# Altium schematic sheet Sheet2.SchDoc
size A3; SheetNumber: 1; SheetTotal: 1
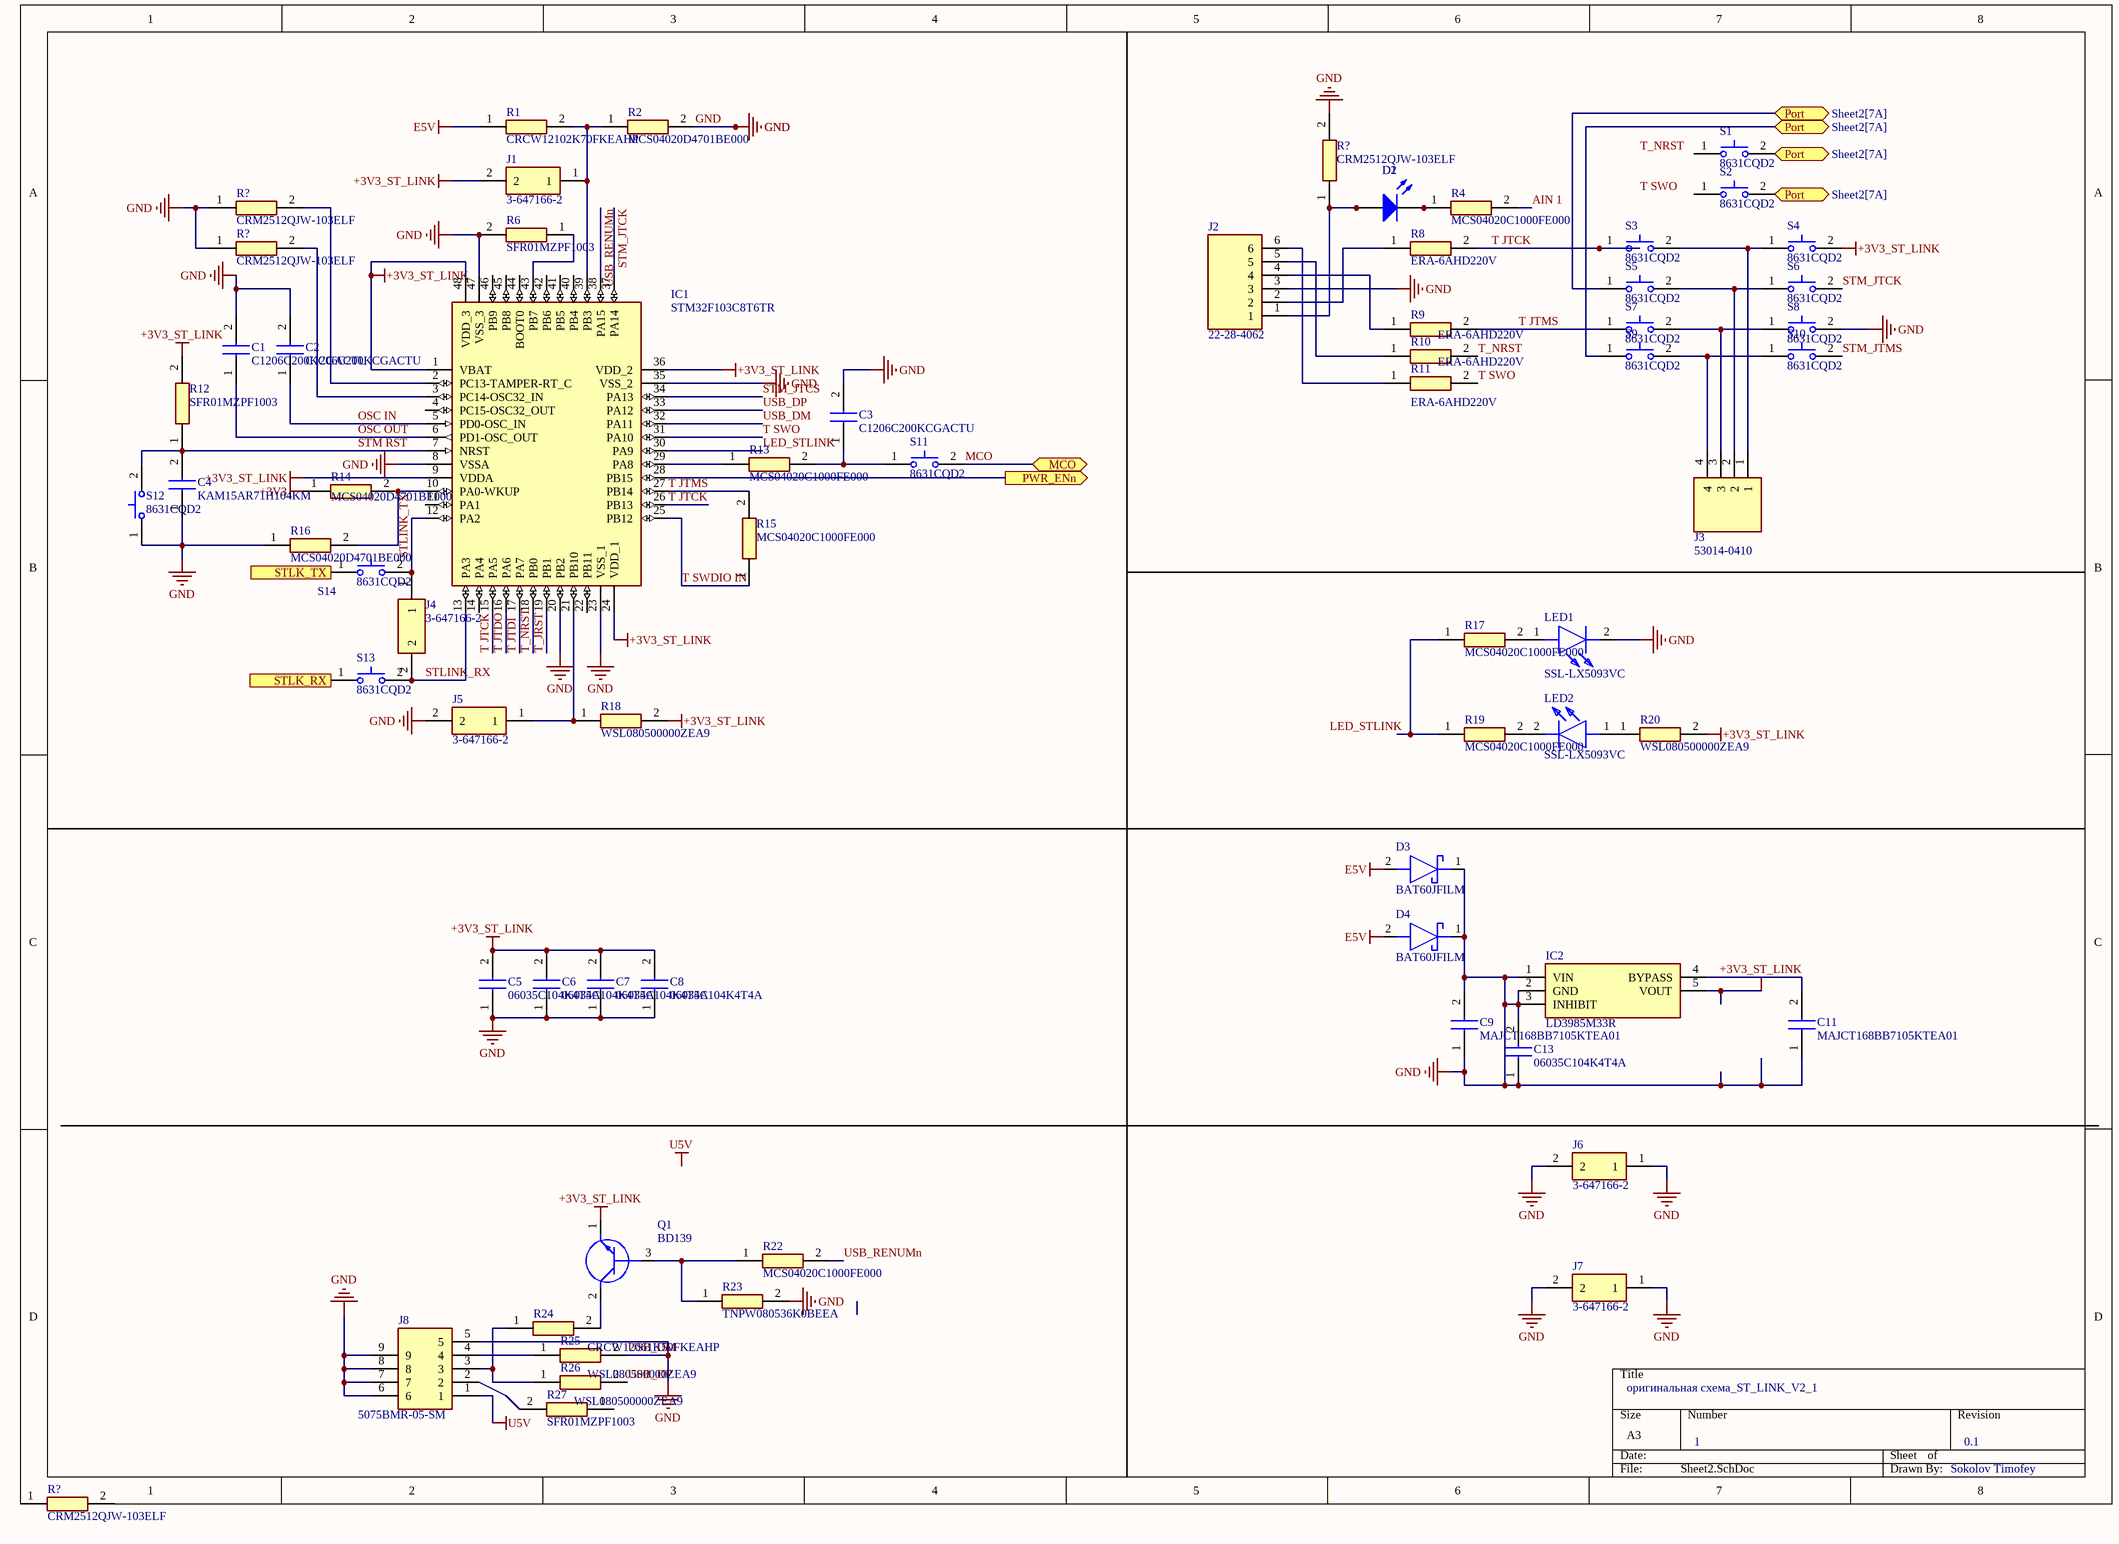
[diagram p0: Sheet2.SchDoc]

## Parts
(Parts that share a designator on the sheet are numbered #1, #2 ... from top to bottom, then left to right.)
C1  C1206C200KCGACTU  [C1206]
C2  C1206C200KCGACTU  [C1206]
C3  C1206C200KCGACTU  [C1206]
C4  KAM15AR71H104KM  [CAPC1608X90N]
C5  06035C104K4T4A  [CAPC1608X90N]
C6  06035C104K4T4A  [CAPC1608X90N]
C7  06035C104K4T4A  [CAPC1608X90N]
C8  06035C104K4T4A  [CAPC1608X90N]
C9  MAJCT168BB7105KTEA01  [MAJx16]
C11  MAJCT168BB7105KTEA01  [MAJx16]
C13  06035C104K4T4A  [CAPC1608X90N]
D1  Light-Emitting Diode  (value not drawn)
D2  Light-Emitting Diode  (value not drawn)
D3  BAT60JFILM  [SOD2513X117N]
D4  BAT60JFILM  [SOD2513X117N]
IC1  STM32F103C8T6TR  [QFP50P900X900X160-48N]
IC2  LD3985M33R  [SOT95P280X145-5N]
J1  3-647166-2  [36471662]
J2  22-28-4062  [HDRV6W66P0X254_1X6_1524X249X838P]
J3  53014-0410  [SHDR4W60P0X200_1X4_1200X435X1000P]
J4  3-647166-2  [36471662]
J5  3-647166-2  [36471662]
J6  3-647166-2  [36471662]
J7  3-647166-2  [36471662]
J8  5075BMR-05-SM  [5075BMR05SM]
LED1  SSL-LX5093VC  [SSLLX5093VC]
LED2  SSL-LX5093VC  [SSLLX5093VC]
Q1  BD139  [TO229P300X760X1364-3P]
R1  CRCW12102K70FKEAHP  [RESC3225X70N]
R2  MCS04020D4701BE000  [RESC1005X37N]
R4  MCS04020C1000FE000  [RESC1005X37N]
R6  SFR01MZPF1003  [RESC1005X40N]
R8  ERA-6AHD220V  [ERA6AEB1020V]
R9  ERA-6AHD220V  [ERA6AEB1020V]
R10  ERA-6AHD220V  [ERA6AEB1020V]
R11  ERA-6AHD220V  [ERA6AEB1020V]
R12  SFR01MZPF1003  [RESC1005X40N]
R13  MCS04020C1000FE000  [RESC1005X37N]
R14  MCS04020D4701BE000  [RESC1005X37N]
R15  MCS04020C1000FE000  [RESC1005X37N]
R16  MCS04020D4701BE000  [RESC1005X37N]
R17  MCS04020C1000FE000  [RESC1005X37N]
R18  WSL080500000ZEA9  [RESC2013X84N]
R19  MCS04020C1000FE000  [RESC1005X37N]
R20  WSL080500000ZEA9  [RESC2013X84N]
R22  MCS04020C1000FE000  [RESC1005X37N]
R23  TNPW080536K0BEEA  [RESC2012X55N]
R24  CRCW12061K50FKEAHP  [RESC3116X65N]
R25  WSL080500000ZEA9  [RESC2013X84N]
R26  WSL080500000ZEA9  [RESC2013X84N]
R27  SFR01MZPF1003  [RESC1005X40N]
R?#1  CRM2512QJW-103ELF  [RESC6331X80N]
R?#2  CRM2512QJW-103ELF  [RESC6331X80N]
R?#3  CRM2512QJW-103ELF  [RESC6331X80N]
R?#4  CRM2512QJW-103ELF  [RESC6331X80N]
S1  8631CQD2  [8631CQD2]
S2  8631CQD2  [8631CQD2]
S3  8631CQD2  [8631CQD2]
S4  8631CQD2  [8631CQD2]
S5  8631CQD2  [8631CQD2]
S6  8631CQD2  [8631CQD2]
S7  8631CQD2  [8631CQD2]
S8  8631CQD2  [8631CQD2]
S9  8631CQD2  [8631CQD2]
S10  8631CQD2  [8631CQD2]
S11  8631CQD2  [8631CQD2]
S12  8631CQD2  [8631CQD2]
S13  8631CQD2  [8631CQD2]
S14  8631CQD2  [8631CQD2]

## Ports
MCO (bidir), Port (bidir, see Sheet2[7A]), PWR_ENn (out), STLK_RX (in), STLK_TX (out)

## Nets
+3V3: R14.1
+3V3_ST_LINK: C5.2 C6.2 C7.2 C8.2 IC1.1(VBAT) IC1.9(VDDA) IC1.24(VDD_1) IC1.36(VDD_2) IC1.48(VDD_3) IC2.5(VOUT) J1.2 Q1.1(E) R12.2 R18.2 R20.2 S4.2(N.O._2)
E5V: D3.2(A) D4.2(A) R1.1
GND: C1.2 C2.2 C3.2 C4.1 C5.1 C6.1 C7.1 C8.1 C9.1 C9.2 C11.1 C13.1 C13.2 D3.1(K) D4.1(K) IC1.8(VSSA) IC1.20(PB2) IC1.23(VSS_1) IC1.32(PA11) IC1.35(VSS_2) IC1.47(VSS_3) IC2.1(VIN) IC2.2(GND) IC2.3(INHIBIT) J2.3 J5.2 J6.1 J6.2 J7.1 J7.2 J8.5 J8.6 J8.7 J8.8 J8.9 LED1.2(K) R2.2 R6.2 R16.1 R23.2 R25.2 R?#1.1 R?#2.2 R?#3.1 S8.2(N.O._2) S12.1(N.O._1)  [also labelled USB_DM]
U5V: J8.1
AIN 1: R4.2
LED_STLINK: IC1.30(PA9)
MCO: S11.2(N.O._2) ; port MCO
OSC IN: C2.1 IC1.5(PD0-OSC_IN)
OSC OUT: C1.1 IC1.6(PD1-OSC_OUT)
Port: S1.2(N.O._2) S2.2(N.O._2) S5.1(N.O._1) S9.1(N.O._1) ; port Port
PWR_ENn: IC1.28(PB15) ; port PWR_ENn
STLINK_RX: IC1.13(PA3) J4.2 S13.2(N.O._2)
STLINK_TX: IC1.12(PA2) J4.1 S14.2(N.O._2)
STLK_RX: S13.1(N.O._1) ; port STLK_RX
STLK_TX: S14.1(N.O._1) ; port STLK_TX
STM RST: C4.2 IC1.7(NRST) R12.1 S12.2(N.O._2)
STM_JTCK: IC1.37(PA14) S6.2(N.O._2)
STM_JTCS: IC1.34(PA13)
STM_JTMS: S10.2(N.O._2)
T JTCK: IC1.15(PA5) IC1.26(PB13) R8.2 S3.1(N.O._1)
T JTDI: IC1.17(PA7)
T JTDO: IC1.16(PA6)
T JTMS: IC1.27(PB14) R9.2 R15.2 S7.1(N.O._1)
T SWDIO IN: IC1.25(PB12) R15.1
T SWO: IC1.31(PA10) R11.2
T_JRST: IC1.19(PB1)
T_NRST: IC1.18(PB0) R10.2
USB_DP: IC1.33(PA12) R26.2
USB_RENUMn: IC1.38(PA15) R22.2
NetC3_1: C3.1 R13.2 S11.1(N.O._1)
NetC11_2: C11.2 IC2.4(BYPASS)
NetD1_1: D1.1(A) D2.1(A) J2.1 R?#2.1
NetD1_2: D1.2(K) D2.2(K) R4.1
NetIC1_2: IC1.2(PC13-TAMPER-RT_C) R?#1.2
NetIC1_3: IC1.3(PC14-OSC32_IN) R?#3.2
NetIC1_10: IC1.10(PA0-WKUP) R14.2 R16.2
NetIC1_21: IC1.21(PB10) J5.1 R18.1
NetIC1_29: IC1.29(PA8) R13.1
NetIC1_39: IC1.39(PB3) J1.1 R1.2 R2.1
NetIC1_43: IC1.43(PB7) R6.1
NetJ2_2: J2.2 R8.1
NetJ2_4: J2.4 R9.1
NetJ2_5: J2.5 R10.1
NetJ2_6: J2.6 R11.1
NetJ3_1: J3.1 S3.2(N.O._2) S4.1(N.O._1)
NetJ3_2: J3.2 S5.2(N.O._2) S6.1(N.O._1)
NetJ3_3: J3.3 S7.2(N.O._2) S8.1(N.O._1)
NetJ3_4: J3.4 S9.2(N.O._2) S10.1(N.O._1)
NetJ8_2: J8.2 R27.2
NetJ8_3: J8.3 R24.1 R26.1
NetJ8_4: J8.4 R25.1
NetLED1_1: LED1.1(A) R17.2
NetLED2_1: LED2.1(A) R20.1
NetLED2_2: LED2.2(K) R19.2
NetQ1_2: Q1.2(C) R24.2
NetQ1_3: Q1.3(B) R22.1 R23.1
NetR17_1: R17.1 R19.1

Not connected (* = marked no-connect by the designer): IC1 4(PC15-OSC32_OUT) 11(PA1) 14(PA4) 22(PB11) 40(PB4) 41(PB5) 42(PB6) 44(BOOT0) 45(PB8) 46(PB9); R27 1; R?#4 1 2; S1 1(N.O._1); S2 1(N.O._1)

## Notes on the sheet
- оригинальная схема_ST_LINK_V2_1
- 1
- 0.1
- Sokolov Timofey
- Labels drawn without touching a wire or pin: LED_STLINK, T SWO, T_NRST, U5V

## Library data of the parts
C1-C3 = C1206C200KCGACTU: Capacitor; Manufacturer_Name: KEMET; Datasheet Link: https://content.kemet.com/datasheets/KEM_C1009_C0G_HV_SMD.pdf; Manufacturer_Part_Number: C1206C200KCGACTU
C4 = KAM15AR71H104KM: Capacitor; Manufacturer_Name: Kyocera AVX; Datasheet Link: https://datasheets.kyocera-avx.com/AutoMLCCKAM.pdf; Height: 0.9mm; Manufacturer_Part_Number: KAM15AR71H104KM; Mouser Part Number: 581-KAM15AR71H104KM; Mouser Price/Stock: https://www.mouser.co.uk/ProductDetail/KYOCERA-AVX/KAM15AR71H104KM?qs=Jm2GQyTW%2FbgzS5FHJWrFzQ%3D%3D; Arrow Part Number: KAM15AR71H104KM; Arrow Price/Stock: https://www.arrow.com/en/products/kam15ar71h104km/avx?region=nac
C5-C8 C13 = 06035C104K4T4A: Capacitor; Manufacturer_Name: Kyocera AVX; Datasheet Link: https://componentsearchengine.com/Datasheets/1/06031A100FAT2A.pdf; Height: 0.9mm; Manufacturer_Part_Number: 06035C104K4T4A; Mouser Part Number: 581-06035C104K4T4A; Mouser Price/Stock: https://www.mouser.co.uk/ProductDetail/KYOCERA-AVX/06035C104K4T4A?qs=NBj5Hwer2CEXBYKT%252BbuSBA%3D%3D; Arrow Part Number: 06035C104K4T4A; Arrow Price/Stock: https://www.arrow.com/en/products/06035c104k4t4a/avx
C9 C11 = MAJCT168BB7105KTEA01: Capacitor; Manufacturer_Name: TAIYO YUDEN; Datasheet Link: https://ds.yuden.co.jp/TYCOMPAS/or/detail?pn=MAJCT168BB7105KTEA01; Height: 0.8mm; Manufacturer_Part_Number: MAJCT168BB7105KTEA01
D1 D2 = LED: AF: 1; BV: 0; BV_MAX: 1e99; EG: 1.11; FC: 0.5; IBV: 0.001; IS: 1e-14; MJSW: 0.33; NTUN: 30; TNOM: 27; XTI: 3; SimulationGenericComponent: True; CJO: 0; CJP: 0; CTA: 0; CTP: 0; FCS: 0.5; FV_MAX: 1e99; IKF: 0; IKR: 0; ISR: 1e-14; JSW: 0; JTUN: 0; JTUNSW: 0; KEG: 1; KF: 0; LEVEL: 1; N: 1; NBV: 1; NR: 1; NS: 1; PHP: 1; RS: 0; TCV: 0; TLEV: 0; TLEVC: 0; TM1: 0; TM2: 0; TPB: 0; TPHP: 0; TRS: 0; TRS2: 0; TT: 0; TTT1: 0; TTT2: 0; VJ: 1; XTITUN: 3
D3 D4 = BAT60JFILM: Schottky Diode; Manufacturer_Name: STMicroelectronics; Datasheet Link: https://www.mouser.jp/datasheet/2/389/cd00001944-1795661.pdf; Height: 1.17mm; Manufacturer_Part_Number: BAT60JFILM; Mouser Part Number: 511-BAT60JFILM; Mouser Price/Stock: https://www.mouser.co.uk/ProductDetail/STMicroelectronics/BAT60JFILM?qs=GnFZssByvVVVnMaukcyLZg%3D%3D; Arrow Part Number: BAT60JFILM; Arrow Price/Stock: https://www.arrow.com/en/products/bat60jfilm/stmicroelectronics?region=nac
IC1 = STM32F103C8T6TR: Integrated Circuit; Manufacturer_Name: STMicroelectronics; Datasheet Link: http://media.digikey.com/pdf/Data%20Sheets/ST%20Microelectronics%20PDFS/STM32F103x8,B.pdf; Height: 1.6mm; Manufacturer_Part_Number: STM32F103C8T6TR; Mouser Part Number: 511-STM32F103C8T6TR; Mouser Price/Stock: https://www.mouser.co.uk/ProductDetail/STMicroelectronics/STM32F103C8T6TR?qs=5HwTSiuA5HDxFj62n06yag%3D%3D; Arrow Part Number: STM32F103C8T6TR; Arrow Price/Stock: https://www.arrow.com/en/products/stm32f103c8t6tr/stmicroelectronics?region=nac
IC2 = LD3985M33R: Integrated Circuit; Manufacturer_Name: STMicroelectronics; Datasheet Link: http://www.st.com/st-web-ui/static/active/en/resource/technical/document/datasheet/CD00003395.pdf; Height: 1.45mm; Manufacturer_Part_Number: LD3985M33R; Mouser Part Number: 511-LD3985M33R; Mouser Price/Stock: https://www.mouser.co.uk/ProductDetail/STMicroelectronics/LD3985M33R?qs=22WmWNTp1rrPOccVv4HZ7A%3D%3D; Arrow Part Number: LD3985M33R; Arrow Price/Stock: https://www.arrow.com/en/products/ld3985m33r/stmicroelectronics?region=europe
J1 J4-J7 = 3-647166-2: Connector; Manufacturer_Name: TE Connectivity; Datasheet Link: https://www.te.com/commerce/DocumentDelivery/DDEController?Action=showdoc&DocId=Customer+Drawing%7F647166%7FR1%7Fpdf%7FEnglish%7FENG_CD_647166_R1.pdf%7F3-647166-2; Height: 10.66mm; Manufacturer_Part_Number: 3-647166-2; Mouser Part Number: 571-3-647166-2; Mouser Price/Stock: https://www.mouser.co.uk/ProductDetail/TE-Connectivity/3-647166-2?qs=xsTFCgGnzbJU1qz6Np9kzA%3D%3D; Arrow Part Number: 3-647166-2; Arrow Price/Stock: https://www.arrow.com/en/products/3-647166-2/te-connectivity?region=nac
J2 = 22-28-4062: Connector; Manufacturer_Name: Molex; Datasheet Link: https://datasheet.datasheetarchive.com/originals/distributors/SFDatasheet-1/sf-00031037.pdf; Height: 8.38mm; Manufacturer_Part_Number: 22-28-4062; Mouser Part Number: 538-22-28-4062; Mouser Price/Stock: https://www.mouser.com/Search/Refine.aspx?Keyword=538-22-28-4062
J3 = 53014-0410: Connector; Manufacturer_Name: Molex; Datasheet Link: https://www.molex.com/pdm_docs/sd/530140410_sd.pdf; Height: 10mm; Manufacturer_Part_Number: 53014-0410; Mouser Part Number: 538-53014-0410; Mouser Price/Stock: https://www.mouser.co.uk/ProductDetail/Molex/53014-0410?qs=TLs3Kb%252BkMqKk8s1WRHwRGw%3D%3D
J8 = 5075BMR-05-SM: Connector; Manufacturer_Name: NELTRON; Datasheet Link: http://www.ibselectronics.com/ibsstore/datasheet/5075BMR-05-SM-CR.pdf; Height: 4mm; Manufacturer_Part_Number: 5075BMR-05-SM
LED1 LED2 = SSL-LX5093VC: LED; Manufacturer_Name: Lumex; Datasheet Link: https://componentsearchengine.com/Datasheets/2/SSL-LX5093VC.pdf; Height: 9.6mm; Manufacturer_Part_Number: SSL-LX5093VC; Mouser Part Number: 696-SSL-LX5093VC; Mouser Price/Stock: https://www.mouser.co.uk/ProductDetail/Lumex/SSL-LX5093VC?qs=94qWIstW55UoxYgVqNRcug%3D%3D; Arrow Part Number: SSL-LX5093VC; Arrow Price/Stock: https://www.arrow.com/en/products/ssl-lx5093vc/lumex?region=nac
Q1 = BD139: Transistor BJT NPN; Manufacturer_Name: onsemi; Datasheet Link: http://www.onsemi.com/pub/Collateral/BD135-D.PDF; Height: 3mm; Manufacturer_Part_Number: BD139; Mouser Part Number: 863-BD139; Mouser Price/Stock: https://www.mouser.co.uk/ProductDetail/onsemi/BD139?qs=vNc2DXHODiI0%252BZZC8g2wVg%3D%3D
R1 = CRCW12102K70FKEAHP: Resistor; Manufacturer_Name: Vishay; Datasheet Link: http://componentsearchengine.com/Datasheets/1/CRCW12102K70FKEAHP.pdf; Height: 0.7mm; Manufacturer_Part_Number: CRCW12102K70FKEAHP; Mouser Part Number: 71-CRCW12102K70FKEAH; Mouser Price/Stock: https://www.mouser.co.uk/ProductDetail/Vishay-Dale/CRCW12102K70FKEAHP?qs=OAzHGkhREL0m0%252BU1n6AaAg%3D%3D
R2 R14 R16 = MCS04020D4701BE000: Resistor; Manufacturer_Name: Vishay; Datasheet Link: http://www.vishay.com/docs/28705/mcx0x0xpro.pdf; Height: 0.37mm; Manufacturer_Part_Number: MCS04020D4701BE000; Mouser Part Number: 594-MCS04020D4701BE0; Mouser Price/Stock: https://www.mouser.co.uk/ProductDetail/Vishay-Beyschlag/MCS04020D4701BE000?qs=ft9OtscSA3%252BR0DpF5QqL2Q%3D%3D
R4 R13 R15 R17 R19 R22 = MCS04020C1000FE000: Resistor; Manufacturer_Name: Vishay; Datasheet Link: http://www.vishay.com/docs/28705/mcx0x0xpro.pdf; Height: 0.37mm; Manufacturer_Part_Number: MCS04020C1000FE000; Mouser Part Number: 594-MCS04020C1000FE0; Mouser Price/Stock: https://www.mouser.co.uk/ProductDetail/Vishay-Beyschlag/MCS04020C1000FE000?qs=7ZE6F4QMOBYkwvQlfbkT8w%3D%3D; Arrow Part Number: MCS04020C1000FE000; Arrow Price/Stock: https://www.arrow.com/en/products/mcs04020c1000fe000/vishay
R6 R12 R27 = SFR01MZPF1003: Resistor; Manufacturer_Name: ROHM Semiconductor; Datasheet Link: https://fscdn.rohm.com/en/products/databook/datasheet/passive/resistor/chip_resistor/sfr-e.pdf; Height: 0.4mm; Manufacturer_Part_Number: SFR01MZPF1003; Mouser Part Number: 755-SFR01MZPF1003; Mouser Price/Stock: https://www.mouser.co.uk/ProductDetail/ROHM-Semiconductor/SFR01MZPF1003?qs=Mv7BduZupUj2RFL5gMaKTg%3D%3D
R8-R11 = ERA-6AHD220V: Resistor; Manufacturer_Name: Panasonic; Datasheet Link: https://industrial.panasonic.com/cdbs/www-data/pdf/RDM0000/AOA0000C307.pdf; Height: 0.6mm; Manufacturer_Part_Number: ERA-6AHD220V; Mouser Part Number: 667-ERA-6AHD220V; Mouser Price/Stock: https://www.mouser.co.uk/ProductDetail/Panasonic/ERA-6AHD220V/?qs=MNPzkKEzRtQTWqg2JSKn2A%3D%3D
R18 R20 R25 R26 = WSL080500000ZEA9: Resistor; Manufacturer_Name: Vishay; Datasheet Link: https://ad.componentsearchengine.com/Datasheets/2/WSL080500000ZEA9.pdf; Height: 0.838mm; Manufacturer_Part_Number: WSL080500000ZEA9; Mouser Part Number: 71-WSL080500000ZEA9; Mouser Price/Stock: https://www.mouser.co.uk/ProductDetail/Vishay-Dale/WSL080500000ZEA9?qs=f1l5vAGoKgsImKS87N8TmQ%3D%3D; Arrow Part Number: WSL080500000ZEA9; Arrow Price/Stock: https://www.arrow.com/en/products/wsl080500000zea9/vishay?region=nac
R23 = TNPW080536K0BEEA: Resistor; Manufacturer_Name: Vishay; Datasheet Link: https://www.vishay.com/docs/31006/tnpw.pdf; Height: 0.55mm; Manufacturer_Part_Number: TNPW080536K0BEEA
R24 = CRCW12061K50FKEAHP: Resistor; Manufacturer_Name: Vishay; Datasheet Link: http://componentsearchengine.com/Datasheets/1/CRCW12061K50FKEAHP.pdf; Height: 0.65mm; Manufacturer_Part_Number: CRCW12061K50FKEAHP; Mouser Part Number: 71-CRCW12061K50FKEAH; Mouser Price/Stock: https://www.mouser.co.uk/ProductDetail/Vishay-Dale/CRCW12061K50FKEAHP?qs=k2%2FDWSARqgEwHXAQbL4aEg%3D%3D; Arrow Part Number: CRCW12061K50FKEAHP; Arrow Price/Stock: https://www.arrow.com/en/products/crcw12061k50fkeahp/vishay?region=nac
R?#1-R?#4 = CRM2512QJW-103ELF: Resistor; Manufacturer_Name: Bourns; Datasheet Link: http://www.bourns.com/data/global/pdfs/CRM0805_1206_2010.pdf; Height: 0.8mm; Manufacturer_Part_Number: CRM2512QJW-103ELF; Mouser Part Number: 652-CRM2512QJW-103E; Mouser Price/Stock: https://www.mouser.co.uk/ProductDetail/Bourns/CRM2512QJW-103ELF?qs=8Wlm6%252BaMh8Rzg3bRHdWGsA%3D%3D; Arrow Part Number: CRM2512QJW-103ELF; Arrow Price/Stock: https://www.arrow.com/en/products/crm2512qjw-103elf/bourns?region=nac
S1-S14 = 8631CQD2: Switch (2-Pin Push); Manufacturer_Name: C & K COMPONENTS; Datasheet Link: https://www.ckswitches.com/media/1396/8600.pdf; Height: 13.93mm; Manufacturer_Part_Number: 8631CQD2; Mouser Part Number: 611-8631-261; Mouser Price/Stock: https://www.mouser.co.uk/ProductDetail/CK/8631CQD2?qs=ktcBc77oICXe9iPhfEwnkA%3D%3D